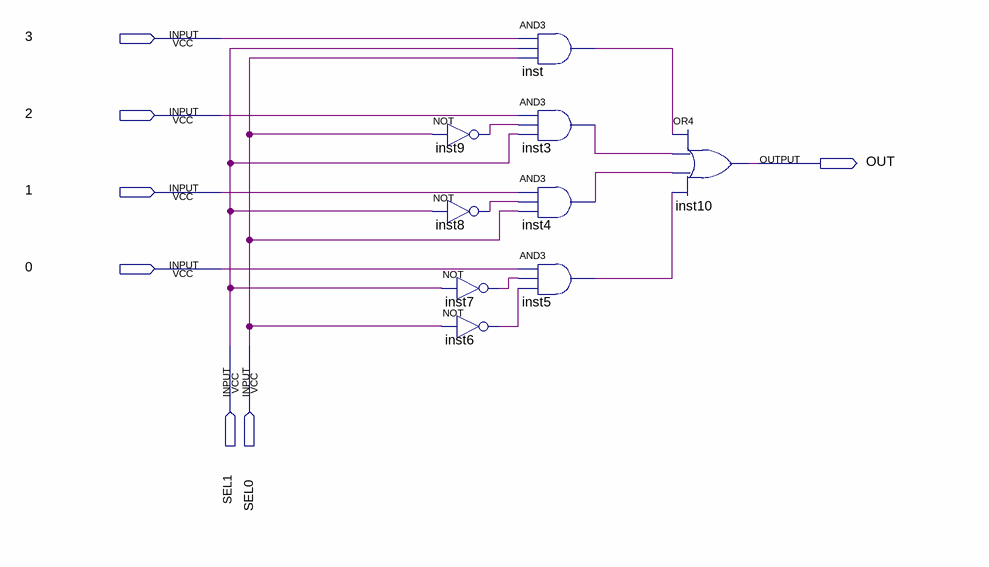
[diagram p0: schematic sheet]
// Quartus schematic mux.bdf as structural Verilog: 9 symbols, 7 pins
module mux (
  input  \3 ,
  input  \2 ,
  input  \1 ,
  input  \0 ,
  input  SEL1,
  input  SEL0,
  output OUT
);

  wire inst3_out, inst4_out, inst5_out, inst6_out, inst7_out, inst8_out, inst9_out, inst_out;

  not inst9 (inst9_out, SEL0);
  not inst8 (inst8_out, SEL1);
  not inst7 (inst7_out, SEL1);
  not inst6 (inst6_out, SEL0);
  and inst (inst_out, \3 , SEL1, SEL0);
  and inst3 (inst3_out, \2 , inst9_out, SEL1);
  and inst4 (inst4_out, \1 , inst8_out, SEL0);
  and inst5 (inst5_out, \0 , inst7_out, inst6_out);
  or inst10 (OUT, inst_out, inst3_out, inst4_out, inst5_out);
endmodule
